# EAGLE design aircopter-v3 (EAGLE 9.4.0)
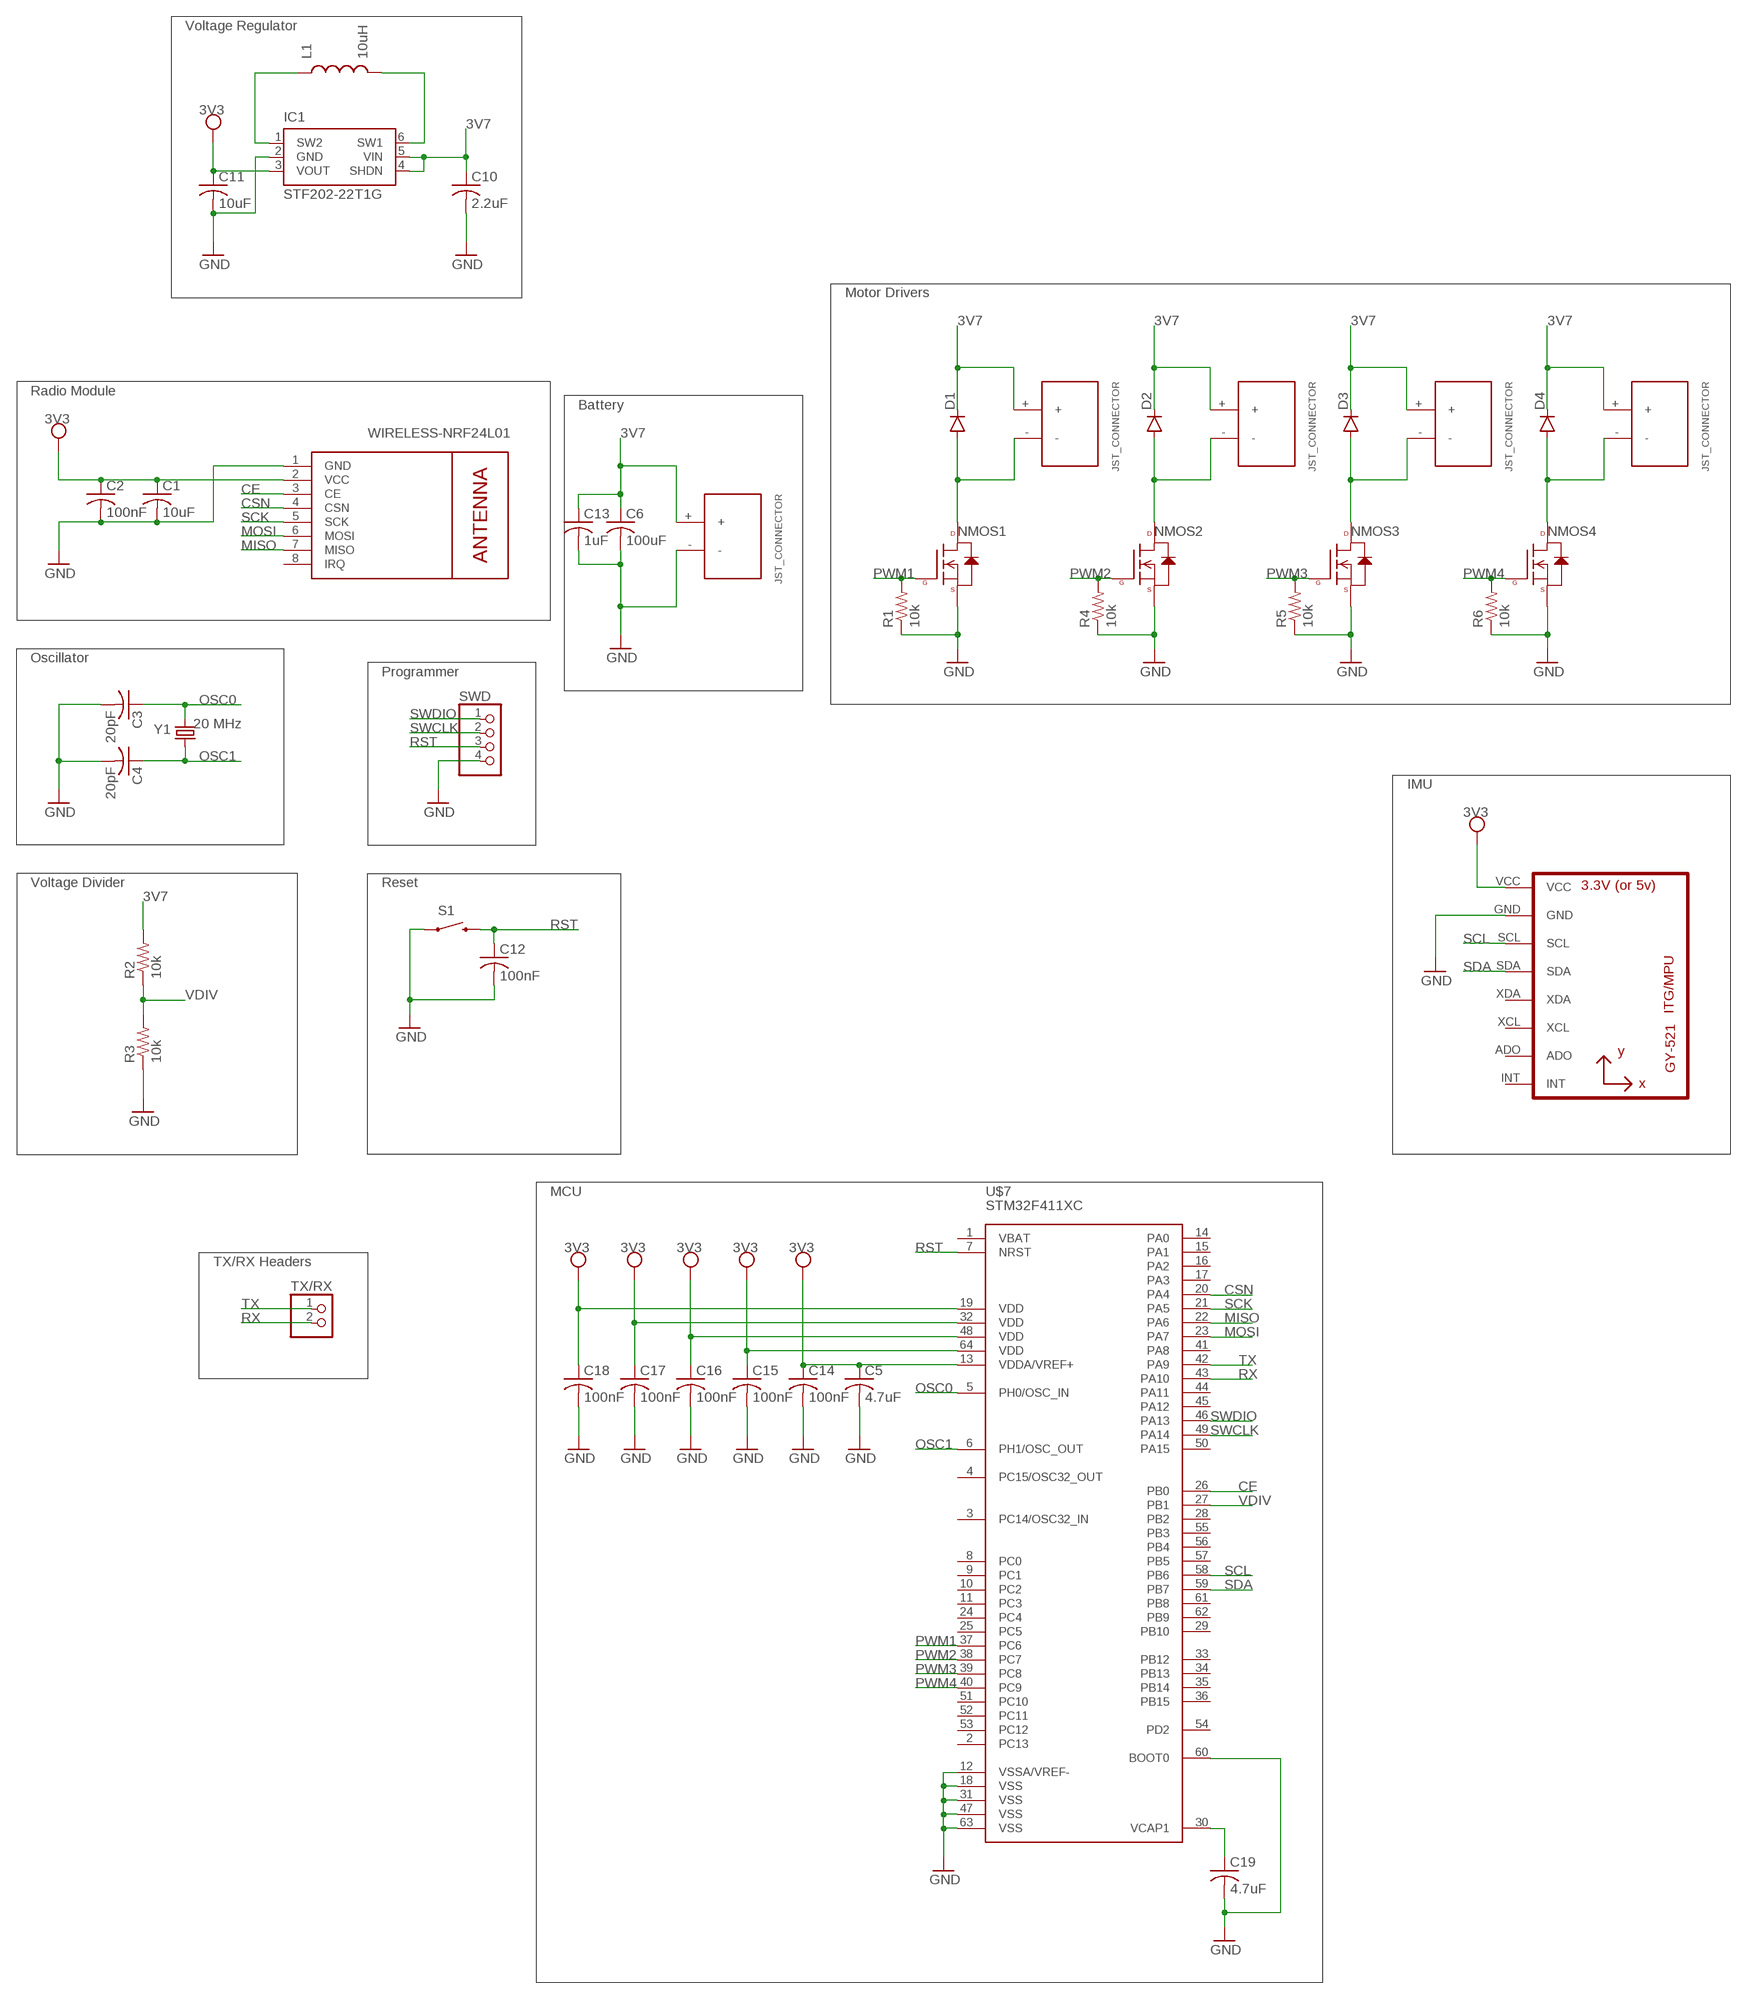
[diagram p0: schematic, sheet 1]

## Parts
C1  10uF  C-USC0603  [C0603]
C2  100nF  C-USC0603  [C0603]
C3  20pF  C-USC0603  [C0603]
C4  20pF  C-USC0603  [C0603]
C5  4.7uF  C-USC0603  [C0603]
C6  100uF  C-USC1206  [C1206]
C10  2.2uF  C-USC0603  [C0603]
C11  10uF  C-USC0603  [C0603]
C12  100nF  C-USC0603  [C0603]
C13  1uF  C-USC0603  [C0603]
C14  100nF  C-USC0603  [C0603]
C15  100nF  C-USC0603  [C0603]
C16  100nF  C-USC0603  [C0603]
C17  100nF  C-USC0603  [C0603]
C18  100nF  C-USC0603  [C0603]
C19  4.7uF  C-USC0603  [C0603]
D1  DIODESMA  [SMA-DIODE]
D2  DIODESMA  [SMA-DIODE]
D3  DIODESMA  [SMA-DIODE]
D4  DIODESMA  [SMA-DIODE]
IC1  STF202-22T1G  [SOT23-6]
L1  10uH  INDUCTOR  [L0603]
M1  WIRELESS-NRF24L01  [WIRELESS-NRF24L01]
NMOS1  N-CHANNEL-MOSFET-BSS138  [SOT23-3]
NMOS2  N-CHANNEL-MOSFET-BSS138  [SOT23-3]
NMOS3  N-CHANNEL-MOSFET-BSS138  [SOT23-3]
NMOS4  N-CHANNEL-MOSFET-BSS138  [SOT23-3]
R1  10k  R-US_R0603  [R0603]
R2  10k  R-US_R0603  [R0603]
R3  10k  R-US_R0603  [R0603]
R4  10k  R-US_R0603  [R0603]
R5  10k  R-US_R0603  [R0603]
R6  10k  R-US_R0603  [R0603]
S1  SWITCH-MOMENTARY-2SMD  [TACTILE-SWITCH-SMD]
SWD  PINHD-1X4  [1X04]
TX/RX  PINHD-1X2  [1X02]
U2  GY-521MPU6050  [GY-521]
U$2  JST_CONNECTOR_FEMALE  [JST_CONNECTOR_FEMALE]
U$3  JST_CONNECTOR_FEMALE  [JST_CONNECTOR_FEMALE]
U$4  JST_CONNECTOR_FEMALE  [JST_CONNECTOR_FEMALE]
U$5  JST_CONNECTOR_FEMALE  [JST_CONNECTOR_FEMALE]
U$6  JST_CONNECTOR_FEMALE  [JST_CONNECTOR_FEMALE]
U$7  STM32F411XC  [LQFP64]
Y1  20 MHz  CRYSTALSMD  [HC49UP]

## Nets
3V3: C1.1 C2.1 C5.1 C11.1 C14.1 C15.1 C16.1 C17.1 C18.1 IC1.3(VOUT) M1.2(VCC) U2.VCC U$7.13(VDDA/VREF+) U$7.19(VDD) U$7.32(VDD) U$7.48(VDD) U$7.64(VDD) ; supply symbol labelled 3V3-CIRCLE
3V7: C6.1 C10.1 C13.1 D1.C D2.C D3.C D4.C IC1.4(SHDN) IC1.5(VIN) R2.2 U$2.+ U$3.+ U$4.+ U$5.+ U$6.+
CE: M1.3(CE) U$7.26(PB0)
CSN: M1.4(CSN) U$7.20(PA4)
GND: C1.2 C2.2 C3.2 C4.2 C5.2 C6.2 C10.2 C11.2 C12.2 C13.2 C14.2 C15.2 C16.2 C17.2 C18.2 C19.2 IC1.2(GND) M1.1(GND) NMOS1.2(S) NMOS2.2(S) NMOS3.2(S) NMOS4.2(S) R1.1 R3.1 R4.1 R5.1 R6.1 S1.1 SWD.4 U2.GND U$6.- U$7.12(VSSA/VREF-) U$7.18(VSS) U$7.31(VSS) U$7.47(VSS) U$7.60(BOOT0) U$7.63(VSS) ; supply symbol labelled SUPPLY1_GND
MISO: M1.7(MISO) U$7.22(PA6)
MOSI: M1.6(MOSI) U$7.23(PA7)
N$1: D1.A NMOS1.3(D) U$2.-
N$2: D2.A NMOS2.3(D) U$3.-
N$3: D3.A NMOS3.3(D) U$4.-
N$4: D4.A NMOS4.3(D) U$5.-
N$5: IC1.1(SW2) L1.1
N$6: IC1.6(SW1) L1.2
N$7: C19.1 U$7.30(VCAP1)
OSC0: C3.1 U$7.5(PH0/OSC_IN) Y1.2
OSC1: C4.1 U$7.6(PH1/OSC_OUT) Y1.1
PWM1: NMOS1.1(G) R1.2 U$7.37(PC6)
PWM2: NMOS2.1(G) R4.2 U$7.38(PC7)
PWM3: NMOS3.1(G) R5.2 U$7.39(PC8)
PWM4: NMOS4.1(G) R6.2 U$7.40(PC9)
RST: C12.1 S1.3 SWD.3 U$7.7(NRST)
RX: TX/RX.2 U$7.43(PA10)
SCK: M1.5(SCK) U$7.21(PA5)
SCL: U2.SCL U$7.58(PB6)
SDA: U2.SDA U$7.59(PB7)
SWCLK: SWD.2 U$7.49(PA14)
SWDIO: SWD.1 U$7.46(PA13)
TX: TX/RX.1 U$7.42(PA9)
VDIV: R2.1 R3.2 U$7.27(PB1)
Unconnected: M1.8(IRQ) U2.ADO U2.INT U2.XCL U2.XDA U$7.1(VBAT) U$7.2(PC13) U$7.3(PC14/OSC32_IN) U$7.4(PC15/OSC32_OUT) U$7.8(PC0) U$7.9(PC1) U$7.10(PC2) U$7.11(PC3) U$7.14(PA0) U$7.15(PA1) U$7.16(PA2) U$7.17(PA3) U$7.24(PC4) U$7.25(PC5) U$7.28(PB2) U$7.29(PB10) U$7.33(PB12) U$7.34(PB13) U$7.35(PB14) U$7.36(PB15) U$7.41(PA8) U$7.44(PA11) U$7.45(PA12) U$7.50(PA15) U$7.51(PC10) U$7.52(PC11) U$7.53(PC12) U$7.54(PD2) U$7.55(PB3) U$7.56(PB4) U$7.57(PB5) U$7.61(PB8) U$7.62(PB9)

## Notes on the sheet
- Voltage Regulator
- Motor Drivers
- Radio Module
- Battery
- Oscillator
- Programmer
- IMU
- Voltage Divider | Reset
- MCU
- TX/RX Headers

## Library data of the parts
C1-C6 C10-C19 = rcl:C-US: CAPACITOR, American symbol; SPICEPREFIX: C
D1-D4 = BeagleBone_Blue_R3:DIODE: Diode These are standard reverse protection diodes and small signal diodes. SMA package can handle up to about 1A. SOD-323 can handle about 200mA. What the SOD-323 package when ordering, there are some mfgs out there that are 5-pin packages.
IC1 = stf202_10:STF202-22T1G: USB Filter with ESD Protection Source: http://www.onsemi.com/pub_link/Collateral/STF202-22T1-D.PDF; MF: ON Semiconductor; MPN: STF202-22T1G; OC_FARNELL: 1651958; OC_NEWARK: 45J2271
L1 = BeagleBone_Blue_R3:INDUCTOR: Inductors Basic Inductor/Choke - 0603 and 1206. Footprints are not proven and vary greatly between part numbers. SRN6045- 33uH, 20% 1.4A
M1 = AP_quad:WIRELESS-NRF24L01: 2.4 GHz Wireless Module based on NRF24L01 chip
NMOS1-NMOS4 = AP_quad:N-CHANNEL-MOSFET: N-Channel MOSFET Mode Field Effect Transistor; DATASHEET: http://www.fairchildsemi.com/ds/BS/BSS138.pdf; DIGIKEY: BSS138TR-ND; ELEMENT14: 2323154; URL: http://au.element14.com/fairchild-semiconductor/bss138/mosfet-n-ch-50v-220ma-sot-23/dp/2323154
R1-R6 = rcl:R-US_: RESISTOR, American symbol; SPICEPREFIX: R
S1 = AP_quad:SWITCH-MOMENTARY-2: Various NO switches- pushbuttons, reed, etc; PROD_ID: SWCH-08247
SWD = pinhead:PINHD-1X4: PIN HEADER
TX/RX = pinhead:PINHD-1X2: PIN HEADER
U2 = Aircopter_quad_lib:GY-521
U$2-U$6 = Aircopter_quad_lib:JST_CONNECTOR_FEMALE
U$7 = Aircopter_quad_lib:STM32F411XC: STM32F411XC
Y1 = Aircopter_quad_lib:CRYSTAL: Crystals Various standard crystals. Proven footprints. Spark Fun Electronics SKU : COM-00534

## Board
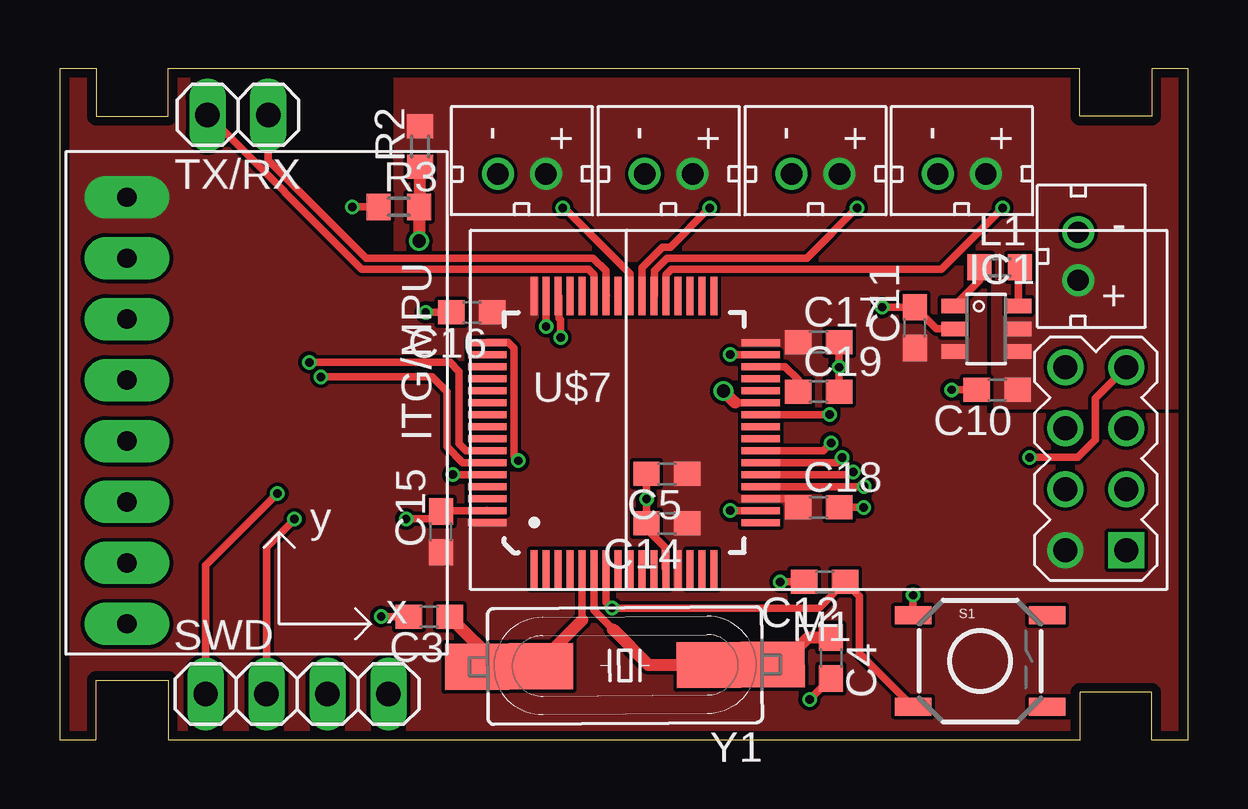
[diagram p1: board, top side]
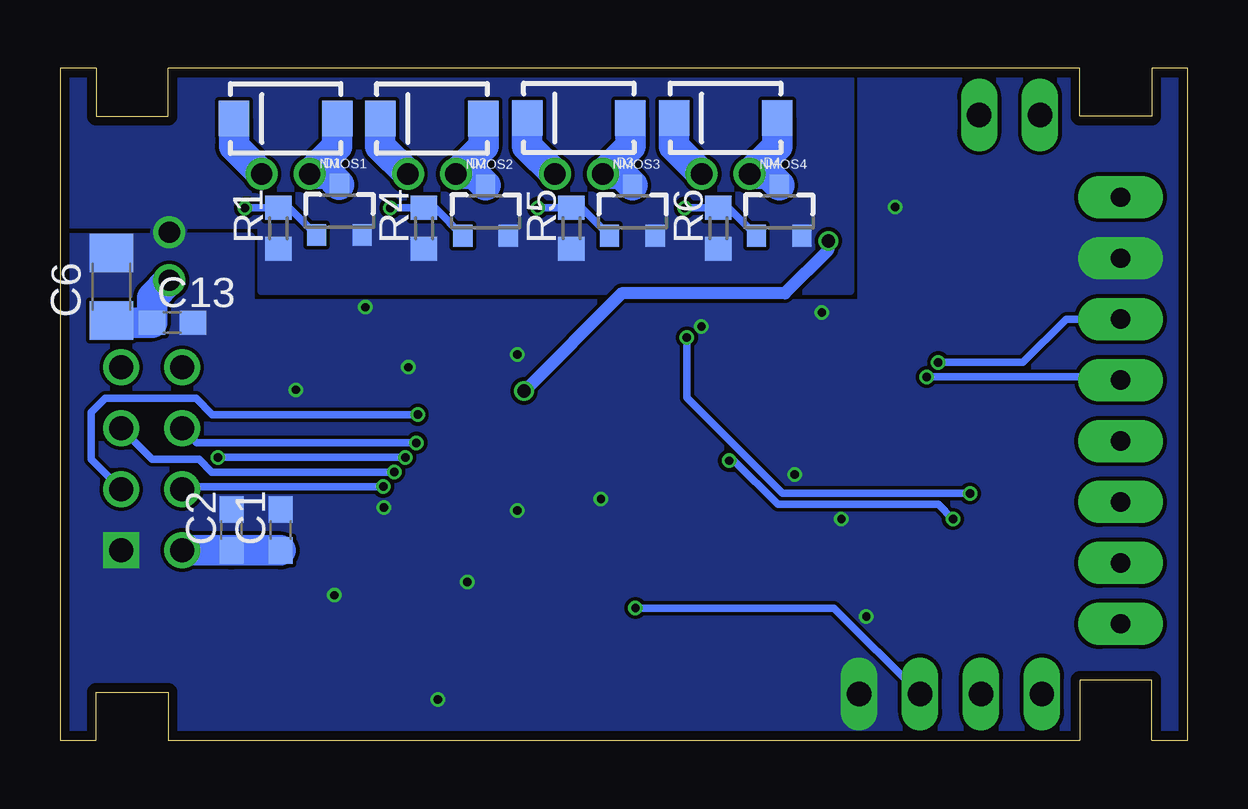
[diagram p2: board, bottom side, seen from below]

Size 47 x 28 mm. Coordinates in mm from the lower left corner, seen from the top.
Outline: 0,0 0,28 1.5,28 1.5,26 4.5,26 4.5,28 42.5,28 42.5,26 45.5,26 45.5,28 47,28 47,0 45.5,0 45.5,2 42.5,2 42.5,0 4.5,0 4.5,2.5 1.5,2.5 1.5,0 0,0
Copper layers (1*16): Top 0.035559375mm / dielectric 1.6mm / Bottom 0.035559375mm
Design rules "oshpark-2layer": minimum track width 6mil, minimum drill 10mil, track to track 6mil, track to pad 6mil, pad to pad 6mil, via to via 6mil, smd to smd 6mil, copper to edge 15mil, drill to drill 6mil, minimum pad ring 5mil, minimum via ring 5mil, stop-mask expansion 2.5mil, vias tented up to drill 0mil, thermal gap 10mil

### Footprints (pad centres in the part's own frame; a part is rotated, then mirrored left to right if it is on the bottom)
C0603 = smd 1.1 x 1: 1 -0.85,0; 2 0.85,0
C1206 = smd 1.6 x 1.8: 1 -1.4,0; 2 1.4,0
SMA-DIODE = smd 1.27 x 1.47: A -2.15,0; C 2.15,0
SOT23-6 = smd 0.6 x 1.05: 1 -0.95,-1.35; 2 0,-1.35; 3 0.95,-1.35; 4 0.95,1.35; 5 0,1.35; 6 -0.95,1.35
L0603 = smd 1 x 1.1: 1 -0.85,0; 2 0.85,0
WIRELESS-NRF24L01 = drill 1 square: 1 -12.7,6.35 | drill 1: 2 -10.16,6.35; 3 -12.7,3.81; 4 -10.16,3.81; 5 -12.7,1.27; 6 -10.16,1.27; 7 -12.7,-1.27; 8 -10.16,-1.27
SOT23-3 = smd 0.8 x 0.9: 1 -0.95,-1; 2 0.95,-1; 3 0,1.1
R0603 = smd 1 x 1.1: 1 -0.85,0; 2 0.85,0
TACTILE-SWITCH-SMD = smd 1.524 x 0.762: 1 -2.794,1.905; 2 2.794,1.905; 3 -2.794,-1.905; 4 2.794,-1.905
1X04 = drill 1.016 long: 1 -3.81,0; 2 -1.27,0; 3 1.27,0; 4 3.81,0
1X02 = drill 1.016 long: 1 -1.27,0; 2 1.27,0
GY-521 = drill 0.8 pad 1.778 long: ADO -8.89,-6.35; GND -8.89,6.35; INT -8.89,-8.89; SCL -8.89,3.81; SDA -8.89,1.27; VCC -8.89,8.89; XCL -8.89,-3.81; XDA -8.89,-1.27
JST_CONNECTOR_FEMALE = drill 0.889: + 0,1; - 0,-1
LQFP64 = smd 0.3 x 1.6: 1 -3.75,-5.7; 2 -3.25,-5.7; 3 -2.75,-5.7; 4 -2.25,-5.7; 5 -1.75,-5.7; 6 -1.25,-5.7; 7 -0.75,-5.7; 8 -0.25,-5.7; 9 0.25,-5.7; 10 0.75,-5.7; 11 1.25,-5.7; 12 1.75,-5.7; 13 2.25,-5.7; 14 2.75,-5.7; 15 3.25,-5.7; 16 3.75,-5.7; 33 3.75,5.7; 34 3.25,5.7; 35 2.75,5.7; 36 2.25,5.7; 37 1.75,5.7; 38 1.25,5.7; 39 0.75,5.7; 40 0.25,5.7; 41 -0.25,5.7; 42 -0.75,5.7; 43 -1.25,5.7; 44 -1.75,5.7; 45 -2.25,5.7; 46 -2.75,5.7; 47 -3.25,5.7; 48 -3.75,5.7 | smd 1.6 x 0.3: 17 5.7,-3.75; 18 5.7,-3.25; 19 5.7,-2.75; 20 5.7,-2.25; 21 5.7,-1.75; 22 5.7,-1.25; 23 5.7,-0.75; 24 5.7,-0.25; 25 5.7,0.25; 26 5.7,0.75; 27 5.7,1.25; 28 5.7,1.75; 29 5.7,2.25; 30 5.7,2.75; 31 5.7,3.25; 32 5.7,3.75; 49 -5.7,3.75; 50 -5.7,3.25; 51 -5.7,2.75; 52 -5.7,2.25; 53 -5.7,1.75; 54 -5.7,1.25; 55 -5.7,0.75; 56 -5.7,0.25; 57 -5.7,-0.25; 58 -5.7,-0.75; 59 -5.7,-1.25; 60 -5.7,-1.75; 61 -5.7,-2.25; 62 -5.7,-2.75; 63 -5.7,-3.25; 64 -5.7,-3.75
HC49UP = smd 5.334 x 1.93: 1 -4.826,0; 2 4.826,0

### Placement (x,y rotation side)
C1  37.8,8.76 90 bottom
C2  39.85,8.76 90 bottom
C3  15.39,5.16 180 top
C4  32.13,3.43 270 top
C5  25.3,11.1 180 top
C6  44.86,18.9 90 bottom
C10  39.07,14.61 180 top
C11  35.64,17.2 90 top
C12  31.88,6.6 180 top
C13  42.32,17.4 0 bottom
C14  25.3,9.04 180 top
C15  15.88,8.69 90 top
C16  17.17,17.83 180 top
C17  31.62,16.59 0 top
C18  31.62,9.7 0 top
C19  31.62,14.53 0 top
D1  37.59,25.91 180 bottom
D2  31.5,25.91 180 bottom
D3  25.37,25.93 180 bottom
D4  19.25,25.93 180 bottom
IC1  38.61,17.14 270 top
L1  39.17,19.71 0 top
M1  31.75,14.27 180 top
NMOS1  35.36,22.05 0 bottom
NMOS2  29.26,22.02 0 bottom
NMOS3  23.14,22.02 0 bottom
NMOS4  17.02,22.02 0 bottom
R1  37.9,21.34 90 bottom
R2  15.01,24.74 90 top
R3  14.12,22.23 0 top
R4  31.83,21.34 90 bottom
R5  25.68,21.34 90 bottom
R6  19.56,21.34 90 bottom
S1  38.35,3.3 0 top
SWD  9.88,1.93 0 top
TX/RX  7.42,26.06 180 top
U2  11.68,13.74 0 top
U$2  37.59,23.6 270 top
U$3  31.5,23.6 270 top
U$4  25.37,23.6 270 top
U$5  19.25,23.6 270 top
U$6  42.44,20.17 180 top
U$7  23.51,12.82 0 top
Y1  23.55,3.11 180.4 top

### Tracks (layer width: path | path; a pad name or v marks a point on that pad's centre or on a via)
3V3
  Top 0.305: U$7.19 30.41,10.07 C18.1
  Bottom 1.27: C1.1 C2.1 39.86,7.92 M1.2
  pour Top (no thermals): 13.59,28.19 13.59,19.63 38.48,19.63 38.48,13.49 47.19,13.49 47.19,-0.23 -0.25,-0.23 -0.25,28.19
3V7
  Bottom 1.27: D4.C 21.4,24.75 U$5.+ | D3.C 27.52,24.75 U$4.+ | D2.C 33.65,24.75 U$3.+ | D1.C 39.74,24.75 U$2.+ | C6.1 44.76,17.4 C13.1 43.17,18.45 U$6.+
  pour Top (no thermals): 14.05,25.88 14.05,20.09 19.51,20.09 38.96,20.09 38.96,14.83 38.96,13.94 40.77,13.94 47.19,13.94 47.19,14.88 47.19,28.19 40.87,28.19 14.05,28.19
CE  (via drill 0.35)
  Top 0.305: U$7.26 v32.08,13.57
  Bottom 0.305: M1.3 45.7,11.71 45.7,13.66 45.11,14.25 41.33,14.25 40.65,13.57 v32.08,13.57
CSN  (via drill 0.35)
  Top 0.305: U$7.20 v33.53,10.57
  Bottom 0.305: v33.53,10.57 41.8,10.57 M1.4
GND  (via drill 0.35)
  Top 0.305: C18.2 v33.5,9.7 | C12.2 v30.02,6.6 | C4.2 31.25,1.7 v31.24,1.7 | U$7.63 15.91,9.57 C15.2 15.56,9.22 v14.43,9.22 | S1.1 v35.56,6.04 | C16.2 v15.24,17.83 | C3.2 v13.39,5.16 | U$7.60 v16.38,11.07 | U$7.12 25.22,7.17 25.22,8.05 24.45,8.82 C14.2 v24.45,10.06 C5.2 | U$7.18 v27.94,9.57 | U$7.31 v27.94,16.07 | IC1.2 36.54,17.14 C11.2 v34.27,18.05 | C19.2 v32.47,15.54 C17.2 | C10.2 v37.16,14.61 | U$7.47 v20.26,17.25 | R3.1 v12.19,22.23
  pour Bottom (no thermals): 43.08,21.26 41.83,21.26 41.83,21.46 38.61,21.46 38.61,20.4 38.61,18.72 22.73,18.72 14.05,18.72 14.05,23.37 14.05,28.19 24.36,28.19 47.8,28.19 47.8,20.68 47.8,-0.2 37.08,-0.2 -0.2,-0.2 -0.2,14.05 -0.2,28.19 13.56,28.19 13.61,28.19 13.61,27.89 13.61,18.24 15.85,18.24 39.04,18.24 39.04,18.69 39.04,21.01 39.42,21.01 41.86,21.01 41.86,21.18 43.1,21.18 43.1,20.98 47.4,20.98 47.4,21.49 43.08,21.49
MISO  (via drill 0.35)
  Top 0.305: U$7.22 32.39,11.57 v32.6,11.79 | M1.7 43.16,14.25 43.16,12.52 42.42,11.79 v40.42,11.79
  Bottom 0.305: v32.6,11.79 | v32.6,11.79 v40.42,11.79
MOSI  (via drill 0.35)
  Top 0.305: U$7.23 31.82,12.07 v32.14,12.39
  Bottom 0.305: v32.14,12.39 41.3,12.39 M1.6
N$1
  Bottom 1.27: D1.A 35.44,24.75 U$2.- 35.81,23.6 NMOS1.3
N$2
  Bottom 1.27: D2.A 29.35,24.75 U$3.- 29.74,23.6 NMOS2.3
N$3
  Bottom 1.27: D3.A 23.23,24.75 U$4.- 23.61,23.6 NMOS3.3
N$4
  Bottom 1.27: D4.A 17.1,24.75 U$5.- 17.49,23.6 NMOS4.3
N$5
  Top 0.305: IC1.1 38.32,19.15 L1.1
N$6
  Top 0.305: IC1.6 39.96,19.65 L1.2
N$7
  Top 0.305: C19.1 30.77,15.02 30.23,15.57 U$7.30
OSC0
  Top 0.305: U$7.5 21.76,5.01 21.77,5
  Top 0.508: C3.1 18.32,3.08 18.57,3.08 Y1.2 19.84,3.08 21.77,5
OSC1
  Top 0.305: U$7.6 22.25,5.41 23.04,4.62 | Y1.1 30,3.15 30.02,3.12
  Top 0.508: C4.1 31.18,4.28 30.02,3.12 | 23.04,4.62 24.52,3.15 Y1.1
PWM1  (via drill 0.35)
  Top 0.305: U$7.37 25.26,19.4 25.49,19.63 36.74,19.63 v39.29,22.19
  Bottom 0.305: NMOS1.1 37.45,22.19 R1.2 v39.29,22.19
PWM2  (via drill 0.35)
  Top 0.305: U$7.38 24.77,18.53 24.77,19.56 25.3,20.09 31.13,20.09 v33.22,22.19
  Bottom 0.305: NMOS2.1 31.38,22.19 R4.2 v33.22,22.19
PWM3  (via drill 0.35)
  Top 0.305: v27.08,22.19 25.44,20.55 25.11,20.55 24.26,19.7 U$7.39
  Bottom 0.305: NMOS3.1 25.25,22.19 R5.2 v27.08,22.19
PWM4  (via drill 0.35)
  Top 0.305: U$7.40 23.76,19.43 21.01,22.19 v20.95,22.19
  Bottom 0.305: NMOS4.1 19.13,22.19 R6.2 v20.95,22.19
RST  (via drill 0.35)
  Top 0.305: S1.3 33.33,3.63 33.33,6.01 C12.1 31.64,5.51 v23.01,5.51 22.76,5.76 U$7.7
  Bottom 0.305: SWD.3 14.73,5.51 v23.01,5.51
RX
  Top 0.305: U$7.43 22.27,19.4 22.03,19.63 12.57,19.63 TX/RX.2
SCK  (via drill 0.35)
  Top 0.305: U$7.21 32.96,11.07 v33.06,11.18
  Bottom 0.305: M1.5 43.16,11.71 41.2,11.71 40.67,11.18 v33.06,11.18
SCL  (via drill 0.35)
  Top 0.305: v10.39,15.75 16.26,15.75 16.64,15.37 16.64,12.37 16.93,12.07 U$7.58
  Bottom 0.305: v10.39,15.75 6.86,15.75 5.05,17.55 U2.SCL
SDA  (via drill 0.35)
  Top 0.305: v10.87,15.14 15.52,15.14 16.13,14.53 16.13,12.23 16.78,11.57 U$7.59
  Bottom 0.305: v10.87,15.14 2.92,15.14 U2.SDA
SWCLK  (via drill 0.35)
  Top 0.305: v9.78,9.22 8.61,8.05 SWD.2 | U$7.49 18.69,16.58 18.93,16.33 18.93,11.83 v19.11,11.65
  Bottom 0.305: v9.78,9.22 10.39,9.83 17.08,9.83 18.9,11.65 v19.11,11.65
SWDIO  (via drill 0.35)
  Top 0.305: v9.07,10.29 6.07,7.29 SWD.1 | U$7.46 20.81,18.48 20.81,17.59 20.87,17.53 v20.87,16.78
  Bottom 0.305: v9.07,10.29 16.89,10.29 20.87,14.27 v20.87,16.78
TX
  Top 0.305: U$7.42 22.78,18.54 22.75,18.56 22.75,19.56 22.22,20.09 12.76,20.09 8.69,24.17 TX/RX.1
VDIV  (via drill 0.55)
  Top 0.305: 28.14,14.07 U$7.27 | R3.2 15.01,22.26
  Top 0.508: 15.01,22.26 R2.1 | R3.2 v14.97,20.81 | v27.66,14.55 28.14,14.07
  Bottom 0.508: v14.97,20.81 14.97,20.42 16.78,18.62 23.6,18.62 v27.66,14.55